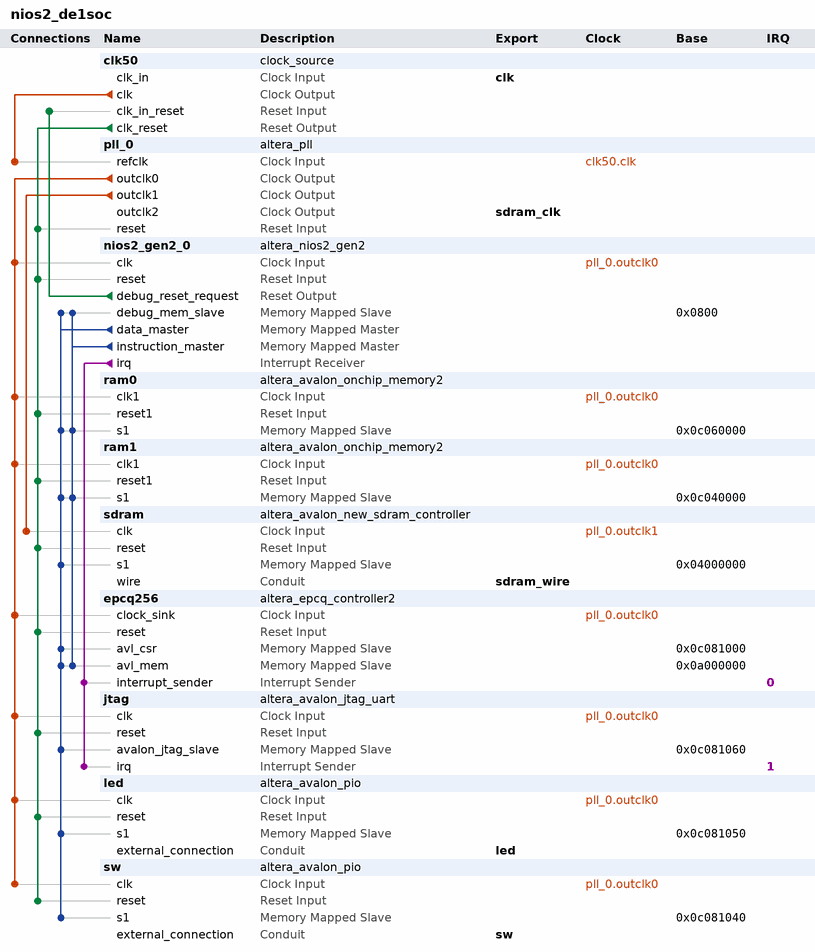
[diagram p0: system contents]
# Platform Designer (Qsys) system nios2_de1soc, Cyclone V 5CSEMA5F31C6
# Parameters at their usual value, and those the tool derives, are not listed.
package require -exact qsys 18.1
create_system nios2_de1soc
set_project_property DEVICE_FAMILY {Cyclone V}
set_project_property DEVICE 5CSEMA5F31C6

add_instance clk50 clock_source 18.1
set_instance_parameter_value clk50 clockFrequency 50000000

add_instance pll_0 altera_pll 18.1
set_instance_parameter_value pll_0 gui_device_speed_grade 1
set_instance_parameter_value pll_0 gui_number_of_clocks 3
set_instance_parameter_value pll_0 gui_operation_mode normal
set_instance_parameter_value pll_0 gui_output_clock_frequency0 50.0
set_instance_parameter_value pll_0 gui_output_clock_frequency1 100.0
set_instance_parameter_value pll_0 gui_output_clock_frequency2 100.0
set_instance_parameter_value pll_0 gui_phase_shift2 -3750
set_instance_parameter_value pll_0 gui_pll_mode {Integer-N PLL}
set_instance_parameter_value pll_0 gui_reference_clock_frequency 50.0
set_instance_parameter_value pll_0 gui_use_locked false

add_instance nios2_gen2_0 altera_nios2_gen2 18.1
set_instance_parameter_value nios2_gen2_0 dcache_size 2048
set_instance_parameter_value nios2_gen2_0 exceptionSlave epcq256.avl_mem
set_instance_parameter_value nios2_gen2_0 icache_size 4096
set_instance_parameter_value nios2_gen2_0 impl Tiny
set_instance_parameter_value nios2_gen2_0 resetSlave epcq256.avl_mem

add_instance ram0 altera_avalon_onchip_memory2 18.1
set_instance_parameter_value ram0 dataWidth 32
set_instance_parameter_value ram0 dualPort false
set_instance_parameter_value ram0 initMemContent true
set_instance_parameter_value ram0 initializationFileName onchip_mem.hex
set_instance_parameter_value ram0 memorySize 131072

add_instance ram1 altera_avalon_onchip_memory2 18.1
set_instance_parameter_value ram1 dataWidth 32
set_instance_parameter_value ram1 dualPort false
set_instance_parameter_value ram1 initMemContent true
set_instance_parameter_value ram1 initializationFileName onchip_mem.hex
set_instance_parameter_value ram1 memorySize 131072

add_instance sdram altera_avalon_new_sdram_controller 18.1
set_instance_parameter_value sdram TAC 5.5
set_instance_parameter_value sdram TRCD 20.0
set_instance_parameter_value sdram TRP 20.0
set_instance_parameter_value sdram casLatency 3
set_instance_parameter_value sdram columnWidth 10
set_instance_parameter_value sdram dataWidth 16
set_instance_parameter_value sdram generateSimulationModel false
set_instance_parameter_value sdram model single_Micron_MT48LC4M32B2_7_chip
set_instance_parameter_value sdram numberOfBanks 4
set_instance_parameter_value sdram numberOfChipSelects 1
set_instance_parameter_value sdram powerUpDelay 100.0
set_instance_parameter_value sdram refreshPeriod 15.625
set_instance_parameter_value sdram rowWidth 13

add_instance epcq256 altera_epcq_controller2 18.1
set_instance_parameter_value epcq256 CHIP_SELS 1
set_instance_parameter_value epcq256 DDASI 0
set_instance_parameter_value epcq256 FLASH_TYPE EPCQ256
set_instance_parameter_value epcq256 IO_MODE QUAD
set_instance_parameter_value epcq256 clkFreq 50000000

add_instance jtag altera_avalon_jtag_uart 18.1
set_instance_parameter_value jtag simInteractiveOptions NO_INTERACTIVE_WINDOWS

add_instance led altera_avalon_pio 18.1
set_instance_parameter_value led direction Output
set_instance_parameter_value led width 8

add_instance sw altera_avalon_pio 18.1
set_instance_parameter_value sw direction Input
set_instance_parameter_value sw width 8

# connections
add_connection clk50.clk pll_0.refclk clock
add_connection pll_0.outclk0 epcq256.clock_sink clock
add_connection pll_0.outclk0 jtag.clk clock
add_connection pll_0.outclk0 led.clk clock
add_connection pll_0.outclk0 nios2_gen2_0.clk clock
add_connection pll_0.outclk0 ram0.clk1 clock
add_connection pll_0.outclk0 ram1.clk1 clock
add_connection pll_0.outclk0 sw.clk clock
add_connection pll_0.outclk1 sdram.clk clock
add_connection clk50.clk_reset epcq256.reset reset
add_connection clk50.clk_reset jtag.reset reset
add_connection clk50.clk_reset led.reset reset
add_connection clk50.clk_reset nios2_gen2_0.reset reset
add_connection clk50.clk_reset pll_0.reset reset
add_connection clk50.clk_reset ram0.reset1 reset
add_connection clk50.clk_reset ram1.reset1 reset
add_connection clk50.clk_reset sdram.reset reset
add_connection clk50.clk_reset sw.reset reset
add_connection nios2_gen2_0.debug_reset_request clk50.clk_in_reset reset
add_connection nios2_gen2_0.data_master epcq256.avl_csr avalon
set_connection_parameter_value nios2_gen2_0.data_master/epcq256.avl_csr baseAddress 0x0c081000
add_connection nios2_gen2_0.data_master epcq256.avl_mem avalon
set_connection_parameter_value nios2_gen2_0.data_master/epcq256.avl_mem baseAddress 0x0a000000
add_connection nios2_gen2_0.data_master jtag.avalon_jtag_slave avalon
set_connection_parameter_value nios2_gen2_0.data_master/jtag.avalon_jtag_slave baseAddress 0x0c081060
add_connection nios2_gen2_0.data_master led.s1 avalon
set_connection_parameter_value nios2_gen2_0.data_master/led.s1 baseAddress 0x0c081050
add_connection nios2_gen2_0.data_master nios2_gen2_0.debug_mem_slave avalon
set_connection_parameter_value nios2_gen2_0.data_master/nios2_gen2_0.debug_mem_slave baseAddress 0x0800
add_connection nios2_gen2_0.data_master ram0.s1 avalon
set_connection_parameter_value nios2_gen2_0.data_master/ram0.s1 baseAddress 0x0c060000
add_connection nios2_gen2_0.data_master ram1.s1 avalon
set_connection_parameter_value nios2_gen2_0.data_master/ram1.s1 baseAddress 0x0c040000
add_connection nios2_gen2_0.data_master sdram.s1 avalon
set_connection_parameter_value nios2_gen2_0.data_master/sdram.s1 baseAddress 0x04000000
add_connection nios2_gen2_0.data_master sw.s1 avalon
set_connection_parameter_value nios2_gen2_0.data_master/sw.s1 baseAddress 0x0c081040
add_connection nios2_gen2_0.instruction_master epcq256.avl_mem avalon
set_connection_parameter_value nios2_gen2_0.instruction_master/epcq256.avl_mem baseAddress 0x0a000000
add_connection nios2_gen2_0.instruction_master nios2_gen2_0.debug_mem_slave avalon
set_connection_parameter_value nios2_gen2_0.instruction_master/nios2_gen2_0.debug_mem_slave baseAddress 0x0800
add_connection nios2_gen2_0.instruction_master ram0.s1 avalon
set_connection_parameter_value nios2_gen2_0.instruction_master/ram0.s1 baseAddress 0x0c060000
add_connection nios2_gen2_0.instruction_master ram1.s1 avalon
set_connection_parameter_value nios2_gen2_0.instruction_master/ram1.s1 baseAddress 0x0c040000
add_connection nios2_gen2_0.irq epcq256.interrupt_sender interrupt
set_connection_parameter_value nios2_gen2_0.irq/epcq256.interrupt_sender irqNumber 0
add_connection nios2_gen2_0.irq jtag.irq interrupt
set_connection_parameter_value nios2_gen2_0.irq/jtag.irq irqNumber 1

# exported interfaces
add_interface clk clock sink
set_interface_property clk EXPORT_OF clk50.clk_in
add_interface led conduit end
set_interface_property led EXPORT_OF led.external_connection
add_interface sdram_clk clock source
set_interface_property sdram_clk EXPORT_OF pll_0.outclk2
add_interface sdram_wire conduit end
set_interface_property sdram_wire EXPORT_OF sdram.wire
add_interface sw conduit end
set_interface_property sw EXPORT_OF sw.external_connection

set_interconnect_requirement {$system} qsys_mm.clockCrossingAdapter HANDSHAKE
set_interconnect_requirement {$system} qsys_mm.enableEccProtection FALSE
set_interconnect_requirement {$system} qsys_mm.insertDefaultSlave FALSE
set_interconnect_requirement {$system} qsys_mm.maxAdditionalLatency 1

save_system nios2_de1soc.qsys
